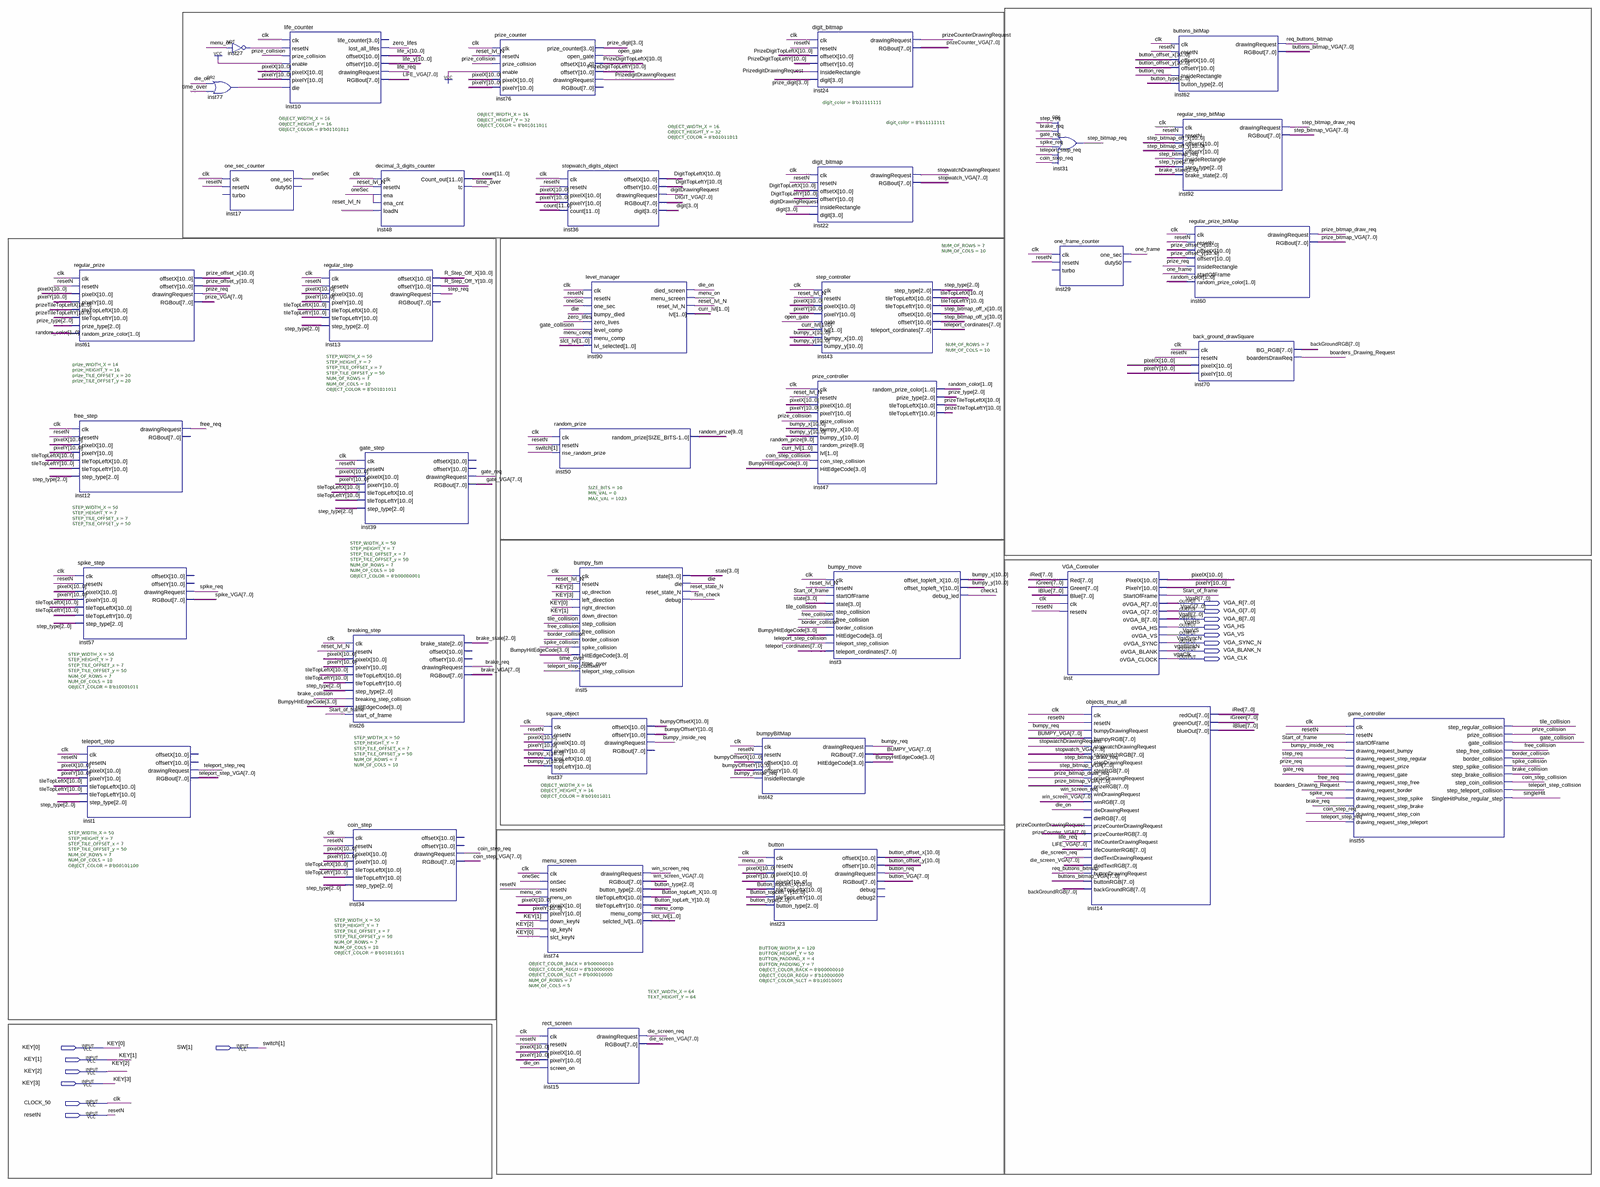
[diagram p0: schematic sheet, whole]
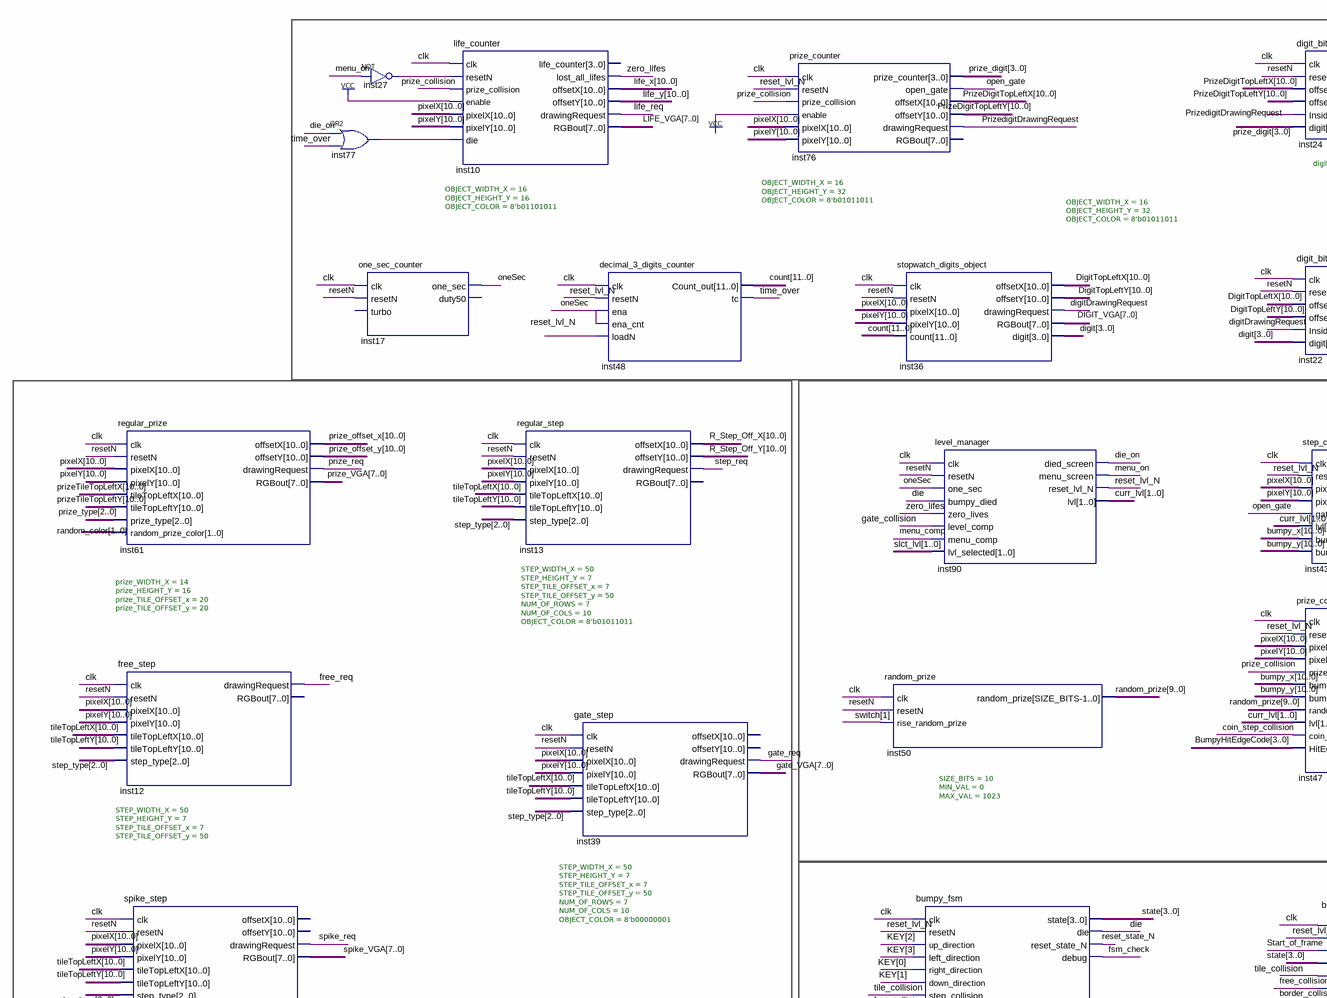
[diagram p1: schematic sheet, upper left part]
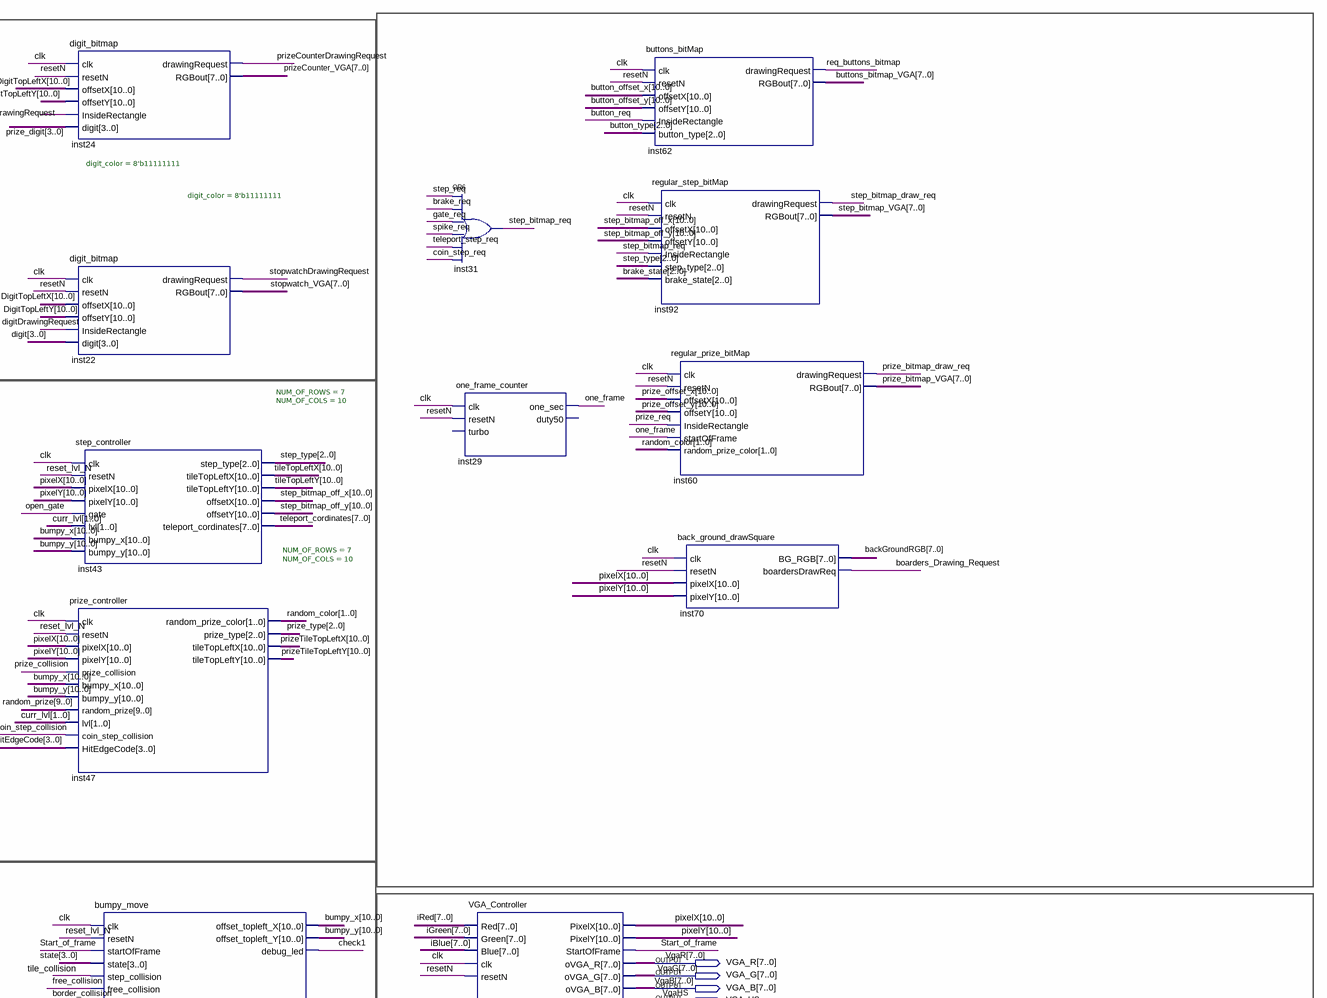
[diagram p2: schematic sheet, upper right part]
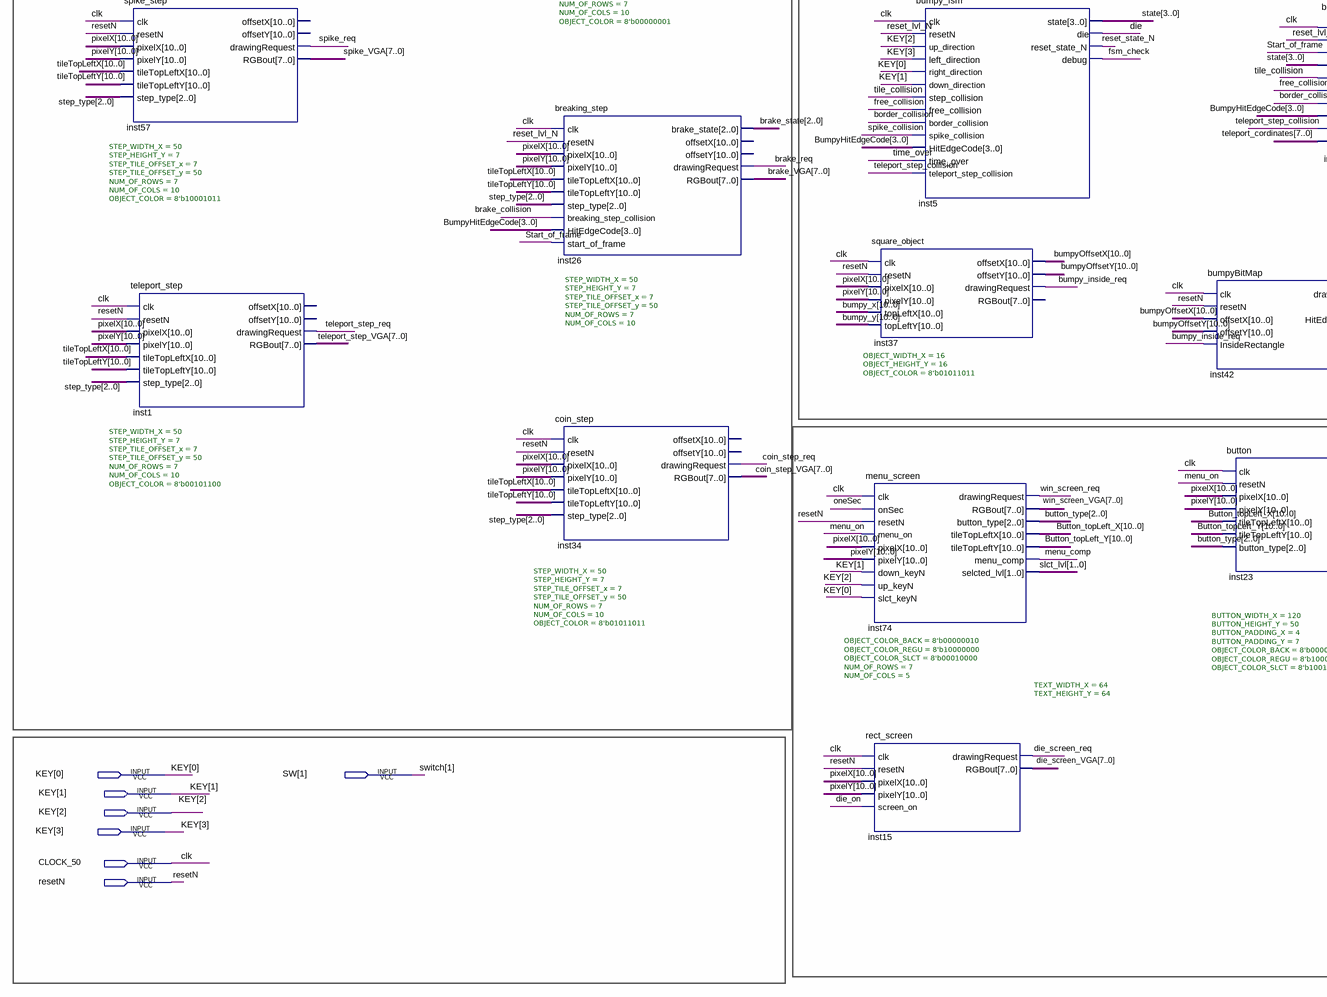
[diagram p3: schematic sheet, lower left part]
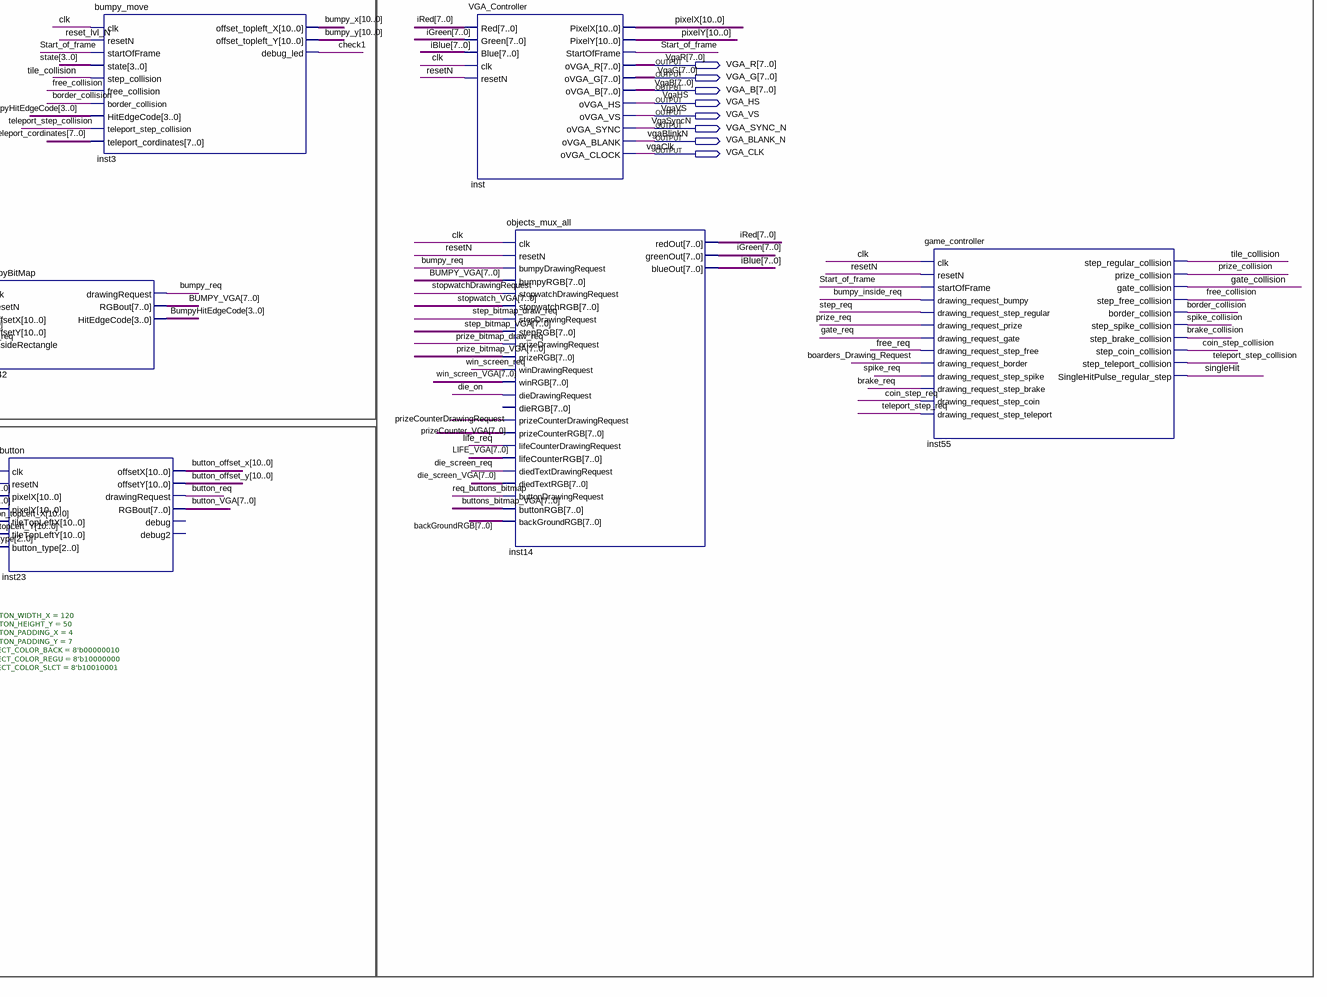
[diagram p4: schematic sheet, lower right part]
// Quartus schematic TOP_VGA_DEMO_WITH_MSS_ALL.bdf as structural Verilog: 37 symbols, 15 pins
module TOP_VGA_DEMO_WITH_MSS_ALL (
  input  [3:0] KEY,
  input  [1:1] SW,
  input  CLOCK_50,
  input  resetN,
  output [7:0] VGA_R,
  output [7:0] VGA_G,
  output [7:0] VGA_B,
  output VGA_HS,
  output VGA_VS,
  output VGA_SYNC_N,
  output VGA_BLANK_N,
  output VGA_CLK
);

  wire boarders_Drawing_Request, border_collision, brake_collision, brake_req, bumpy_inside_req, bumpy_req,
       button_req, check1, coin_step_collision, coin_step_req, die, die_on, die_screen_req,
       digitDrawingRequest, free_collision, free_req, fsm_check, gate_collision, gate_req, inst27_out,
       inst77_out, life_req, menu_comp, menu_on, one_frame, oneSec, open_gate, prize_bitmap_draw_req,
       prize_collision, prize_req, prizeCounterDrawingRequest, PrizedigitDrawingRequest, req_buttons_bitmap,
       reset_lvl_N, reset_state_N, singleHit, spike_collision, spike_req, Start_of_frame,
       step_bitmap_draw_req, step_bitmap_req, step_req, stopwatchDrawingRequest, teleport_step_collision,
       teleport_step_req, tile_collision, time_over, win_screen_req, zero_lifes;
  wire [1:0] curr_lvl, random_color, slct_lvl;
  wire [2:0] brake_state, button_type, prize_type, step_type;
  wire [3:0] BumpyHitEdgeCode, digit, prize_digit, state;
  wire [7:0] backGroundRGB, brake_VGA, BUMPY_VGA, button_VGA, buttons_bitmap_VGA, coin_step_VGA,
       die_screen_VGA, DIGIT_VGA, gate_VGA, iBlue, iGreen, iRed, LIFE_VGA, prize_bitmap_VGA, prize_VGA,
       prizeCounter_VGA, spike_VGA, step_bitmap_VGA, stopwatch_VGA, teleport_cordinates, teleport_step_VGA,
       win_screen_VGA;
  wire [9:0] random_prize;
  wire [10:0] bumpy_x, bumpy_y, bumpyOffsetX, bumpyOffsetY, button_offset_x, button_offset_y,
       Button_topLeft_X, Button_topLeft_Y, DigitTopLeftX, DigitTopLeftY, life_x, life_y, pixelX, pixelY,
       prize_offset_x, prize_offset_y, PrizeDigitTopLeftX, PrizeDigitTopLeftY, prizeTileTopLeftX,
       prizeTileTopLeftY, R_Step_Off_X, R_Step_Off_Y, step_bitmap_off_x, step_bitmap_off_y, tileTopLeftX,
       tileTopLeftY;
  wire [11:0] count;

  regular_prize #(.prize_WIDTH_X(14), .prize_HEIGHT_Y(16), .prize_TILE_OFFSET_x(20), .prize_TILE_OFFSET_y(20)) inst61 (
    .clk(CLOCK_50), .resetN(resetN), .pixelX(pixelX), .pixelY(pixelY), .tileTopLeftX(prizeTileTopLeftX),
    .tileTopLeftY(prizeTileTopLeftY), .prize_type(prize_type), .random_prize_color(random_color),
    .offsetX(prize_offset_x), .offsetY(prize_offset_y), .drawingRequest(prize_req), .RGBout(prize_VGA));
  free_step #(.STEP_WIDTH_X(50), .STEP_HEIGHT_Y(7), .STEP_TILE_OFFSET_x(7), .STEP_TILE_OFFSET_y(50)) inst12 (
    .clk(CLOCK_50), .resetN(resetN), .pixelX(pixelX), .pixelY(pixelY), .tileTopLeftX(tileTopLeftX),
    .tileTopLeftY(tileTopLeftY), .step_type(step_type), .drawingRequest(free_req));  // open: RGBout
  spike_step #(.STEP_WIDTH_X(50), .STEP_HEIGHT_Y(7), .STEP_TILE_OFFSET_x(7), .STEP_TILE_OFFSET_y(50), .NUM_OF_ROWS(7), .NUM_OF_COLS(10), .OBJECT_COLOR(8'b10001011)) inst57 (
    .clk(CLOCK_50), .resetN(resetN), .pixelX(pixelX), .pixelY(pixelY), .tileTopLeftX(tileTopLeftX),
    .tileTopLeftY(tileTopLeftY), .step_type(step_type), .drawingRequest(spike_req), .RGBout(spike_VGA));  // open: offsetX, offsetY
  teleport_step #(.STEP_WIDTH_X(50), .STEP_HEIGHT_Y(7), .STEP_TILE_OFFSET_x(7), .STEP_TILE_OFFSET_y(50), .NUM_OF_ROWS(7), .NUM_OF_COLS(10), .OBJECT_COLOR(8'b00101100)) inst1 (
    .clk(CLOCK_50), .resetN(resetN), .pixelX(pixelX), .pixelY(pixelY), .tileTopLeftX(tileTopLeftX),
    .tileTopLeftY(tileTopLeftY), .step_type(step_type), .drawingRequest(teleport_step_req),
    .RGBout(teleport_step_VGA));  // open: offsetX, offsetY
  not inst27 (inst27_out, menu_on);
  or inst77 (inst77_out, die_on, time_over);
  one_sec_counter inst17 (.clk(CLOCK_50), .resetN(resetN), .one_sec(oneSec));  // open: turbo, duty50
  life_counter #(.OBJECT_WIDTH_X(16), .OBJECT_HEIGHT_Y(16), .OBJECT_COLOR(8'b01101011)) inst10 (
    .clk(CLOCK_50), .resetN(inst27_out), .prize_collision(prize_collision), .enable(1'b1), .pixelX(pixelX),
    .pixelY(pixelY), .die(inst77_out), .lost_all_lifes(zero_lifes), .offsetX(life_x), .offsetY(life_y),
    .drawingRequest(life_req), .RGBout(LIFE_VGA));  // open: life_counter
  regular_step #(.STEP_WIDTH_X(50), .STEP_HEIGHT_Y(7), .STEP_TILE_OFFSET_x(7), .STEP_TILE_OFFSET_y(50), .NUM_OF_ROWS(7), .NUM_OF_COLS(10), .OBJECT_COLOR(8'b01011011)) inst13 (
    .clk(CLOCK_50), .resetN(resetN), .pixelX(pixelX), .pixelY(pixelY), .tileTopLeftX(tileTopLeftX),
    .tileTopLeftY(tileTopLeftY), .step_type(step_type), .offsetX(R_Step_Off_X), .offsetY(R_Step_Off_Y),
    .drawingRequest(step_req));  // open: RGBout
  breaking_step #(.STEP_WIDTH_X(50), .STEP_HEIGHT_Y(7), .STEP_TILE_OFFSET_x(7), .STEP_TILE_OFFSET_y(50), .NUM_OF_ROWS(7), .NUM_OF_COLS(10)) inst26 (
    .clk(CLOCK_50), .resetN(reset_lvl_N), .pixelX(pixelX), .pixelY(pixelY), .tileTopLeftX(tileTopLeftX),
    .tileTopLeftY(tileTopLeftY), .step_type(step_type), .breaking_step_collision(brake_collision),
    .HitEdgeCode(BumpyHitEdgeCode), .start_of_frame(Start_of_frame), .brake_state(brake_state),
    .drawingRequest(brake_req), .RGBout(brake_VGA));  // open: offsetX, offsetY
  coin_step #(.STEP_WIDTH_X(50), .STEP_HEIGHT_Y(7), .STEP_TILE_OFFSET_x(7), .STEP_TILE_OFFSET_y(50), .NUM_OF_ROWS(7), .NUM_OF_COLS(10), .OBJECT_COLOR(8'b01011011)) inst34 (
    .clk(CLOCK_50), .resetN(resetN), .pixelX(pixelX), .pixelY(pixelY), .tileTopLeftX(tileTopLeftX),
    .tileTopLeftY(tileTopLeftY), .step_type(step_type), .drawingRequest(coin_step_req), .RGBout(coin_step_VGA));  // open: offsetX, offsetY
  decimal_3_digits_counter inst48 (
    .clk(CLOCK_50), .resetN(reset_lvl_N), .ena(oneSec), .ena_cnt(oneSec), .loadN(reset_lvl_N),
    .Count_out(count), .tc(time_over));
  gate_step #(.STEP_WIDTH_X(50), .STEP_HEIGHT_Y(7), .STEP_TILE_OFFSET_x(7), .STEP_TILE_OFFSET_y(50), .NUM_OF_ROWS(7), .NUM_OF_COLS(10), .OBJECT_COLOR(8'b00000001)) inst39 (
    .clk(CLOCK_50), .resetN(resetN), .pixelX(pixelX), .pixelY(pixelY), .tileTopLeftX(tileTopLeftX),
    .tileTopLeftY(tileTopLeftY), .step_type(step_type), .drawingRequest(gate_req), .RGBout(gate_VGA));  // open: offsetX, offsetY
  prize_counter #(.OBJECT_WIDTH_X(16), .OBJECT_HEIGHT_Y(32), .OBJECT_COLOR(8'b01011011)) inst76 (
    .clk(CLOCK_50), .resetN(reset_lvl_N), .prize_collision(prize_collision), .enable(1'b1), .pixelX(pixelX),
    .pixelY(pixelY), .prize_counter(prize_digit), .open_gate(open_gate), .offsetX(PrizeDigitTopLeftX),
    .offsetY(PrizeDigitTopLeftY), .drawingRequest(PrizedigitDrawingRequest));  // open: RGBout
  square_object #(.OBJECT_WIDTH_X(16), .OBJECT_HEIGHT_Y(16), .OBJECT_COLOR(8'b01011011)) inst37 (
    .clk(CLOCK_50), .resetN(resetN), .pixelX(pixelX), .pixelY(pixelY), .topLeftX(bumpy_x),
    .topLeftY(bumpy_y), .offsetX(bumpyOffsetX), .offsetY(bumpyOffsetY), .drawingRequest(bumpy_inside_req));  // open: RGBout
  menu_screen #(.OBJECT_COLOR_BACK(8'b00000010), .OBJECT_COLOR_REGU(8'b10000000), .OBJECT_COLOR_SLCT(8'b00010000), .NUM_OF_ROWS(7), .NUM_OF_COLS(5)) inst74 (
    .clk(CLOCK_50), .onSec(oneSec), .resetN(resetN), .menu_on(menu_on), .pixelX(pixelX), .pixelY(pixelY),
    .down_keyN(KEY[1]), .up_keyN(KEY[2]), .slct_keyN(KEY[0]), .drawingRequest(win_screen_req),
    .RGBout(win_screen_VGA), .button_type(button_type), .tileTopLeftX(Button_topLeft_X),
    .tileTopLeftY(Button_topLeft_Y), .menu_comp(menu_comp), .selcted_lvl(slct_lvl));
  rect_screen #(.TEXT_WIDTH_X(64), .TEXT_HEIGHT_Y(64)) inst15 (
    .clk(CLOCK_50), .resetN(resetN), .pixelX(pixelX), .pixelY(pixelY), .screen_on(die_on),
    .drawingRequest(die_screen_req), .RGBout(die_screen_VGA));
  stopwatch_digits_object #(.OBJECT_WIDTH_X(16), .OBJECT_HEIGHT_Y(32), .OBJECT_COLOR(8'b01011011)) inst36 (
    .clk(CLOCK_50), .resetN(resetN), .pixelX(pixelX), .pixelY(pixelY), .count(count),
    .offsetX(DigitTopLeftX), .offsetY(DigitTopLeftY), .drawingRequest(digitDrawingRequest),
    .RGBout(DIGIT_VGA), .digit(digit));
  random_prize #(.SIZE_BITS(10), .MIN_VAL(0), .MAX_VAL(1023)) inst50 (
    .clk(CLOCK_50), .resetN(resetN), .rise_random_prize(SW[1]), .random_prize(random_prize));
  bumpy_fsm inst5 (
    .clk(CLOCK_50), .resetN(reset_lvl_N), .up_direction(KEY[2]), .left_direction(KEY[3]),
    .right_direction(KEY[0]), .down_direction(KEY[1]), .step_collision(tile_collision),
    .free_collision(free_collision), .border_collision(border_collision), .spike_collision(spike_collision),
    .HitEdgeCode(BumpyHitEdgeCode), .time_over(time_over), .teleport_step_collision(teleport_step_collision),
    .state(state), .die(die), .reset_state_N(reset_state_N), .debug(fsm_check));
  level_manager inst90 (
    .clk(CLOCK_50), .resetN(resetN), .one_sec(oneSec), .bumpy_died(die), .zero_lives(zero_lifes),
    .level_comp(gate_collision), .menu_comp(menu_comp), .lvl_selected(slct_lvl), .died_screen(die_on),
    .menu_screen(menu_on), .reset_lvl_N(reset_lvl_N), .lvl(curr_lvl));
  bumpyBitMap inst42 (
    .clk(CLOCK_50), .resetN(resetN), .offsetX(bumpyOffsetX), .offsetY(bumpyOffsetY),
    .InsideRectangle(bumpy_inside_req), .drawingRequest(bumpy_req), .RGBout(BUMPY_VGA),
    .HitEdgeCode(BumpyHitEdgeCode));
  button #(.BUTTON_WIDTH_X(120), .BUTTON_HEIGHT_Y(50), .BUTTON_PADDING_X(4), .BUTTON_PADDING_Y(7), .OBJECT_COLOR_BACK(8'b00000010), .OBJECT_COLOR_REGU(8'b10000000), .OBJECT_COLOR_SLCT(8'b10010001)) inst23 (
    .clk(CLOCK_50), .resetN(menu_on), .pixelX(pixelX), .pixelY(pixelY), .tileTopLeftX(Button_topLeft_X),
    .tileTopLeftY(Button_topLeft_Y), .button_type(button_type), .offsetX(button_offset_x),
    .offsetY(button_offset_y), .drawingRequest(button_req), .RGBout(button_VGA));  // open: debug, debug2
  digit_bitmap #(.digit_color(8'b11111111)) inst24 (
    .clk(CLOCK_50), .resetN(resetN), .offsetX(PrizeDigitTopLeftX), .offsetY(PrizeDigitTopLeftY),
    .InsideRectangle(PrizedigitDrawingRequest), .digit(prize_digit),
    .drawingRequest(prizeCounterDrawingRequest), .RGBout(prizeCounter_VGA));
  digit_bitmap #(.digit_color(8'b11111111)) inst22 (
    .clk(CLOCK_50), .resetN(resetN), .offsetX(DigitTopLeftX), .offsetY(DigitTopLeftY),
    .InsideRectangle(digitDrawingRequest), .digit(digit), .drawingRequest(stopwatchDrawingRequest),
    .RGBout(stopwatch_VGA));
  step_controller #(.NUM_OF_ROWS(7), .NUM_OF_COLS(10)) inst43 (
    .clk(CLOCK_50), .resetN(reset_lvl_N), .pixelX(pixelX), .pixelY(pixelY), .gate(open_gate), .lvl(curr_lvl),
    .bumpy_x(bumpy_x), .bumpy_y(bumpy_y), .step_type(step_type), .tileTopLeftX(tileTopLeftX),
    .tileTopLeftY(tileTopLeftY), .offsetX(step_bitmap_off_x), .offsetY(step_bitmap_off_y),
    .teleport_cordinates(teleport_cordinates));
  prize_controller #(.NUM_OF_ROWS(7), .NUM_OF_COLS(10)) inst47 (
    .clk(CLOCK_50), .resetN(reset_lvl_N), .pixelX(pixelX), .pixelY(pixelY),
    .prize_collision(prize_collision), .bumpy_x(bumpy_x), .bumpy_y(bumpy_y), .random_prize(random_prize),
    .lvl(curr_lvl), .coin_step_collision(coin_step_collision), .HitEdgeCode(BumpyHitEdgeCode),
    .random_prize_color(random_color), .prize_type(prize_type), .tileTopLeftX(prizeTileTopLeftX),
    .tileTopLeftY(prizeTileTopLeftY));
  bumpy_move inst3 (
    .clk(CLOCK_50), .resetN(reset_lvl_N), .startOfFrame(Start_of_frame), .state(state),
    .step_collision(tile_collision), .free_collision(free_collision), .border_collision(border_collision),
    .HitEdgeCode(BumpyHitEdgeCode), .teleport_step_collision(teleport_step_collision),
    .teleport_cordinates(teleport_cordinates), .offset_topleft_X(bumpy_x), .offset_topleft_Y(bumpy_y),
    .debug_led(check1));
  or inst31 (step_bitmap_req, step_req, brake_req, gate_req, spike_req, teleport_step_req, coin_step_req);
  one_frame_counter inst29 (.clk(CLOCK_50), .resetN(resetN), .one_sec(one_frame));  // open: turbo, duty50
  VGA_Controller inst (
    .Red(iRed), .Green(iGreen), .Blue(iBlue), .clk(CLOCK_50), .resetN(resetN), .PixelX(pixelX),
    .PixelY(pixelY), .StartOfFrame(Start_of_frame), .oVGA_R(VGA_R), .oVGA_G(VGA_G), .oVGA_B(VGA_B),
    .oVGA_HS(VGA_HS), .oVGA_VS(VGA_VS), .oVGA_SYNC(VGA_SYNC_N), .oVGA_BLANK(VGA_BLANK_N), .oVGA_CLOCK(VGA_CLK));
  objects_mux_all inst14 (
    .clk(CLOCK_50), .resetN(resetN), .bumpyDrawingRequest(bumpy_req), .bumpyRGB(BUMPY_VGA),
    .stopwatchDrawingRequest(stopwatchDrawingRequest), .stopwatchRGB(stopwatch_VGA),
    .stepDrawingRequest(step_bitmap_draw_req), .stepRGB(step_bitmap_VGA),
    .prizeDrawingRequest(prize_bitmap_draw_req), .prizeRGB(prize_bitmap_VGA),
    .winDrawingRequest(win_screen_req), .winRGB(win_screen_VGA), .dieDrawingRequest(die_on),
    .prizeCounterDrawingRequest(prizeCounterDrawingRequest), .prizeCounterRGB(prizeCounter_VGA),
    .lifeCounterDrawingRequest(life_req), .lifeCounterRGB(LIFE_VGA), .diedTextDrawingRequest(die_screen_req),
    .diedTextRGB(die_screen_VGA), .buttonDrawingRequest(req_buttons_bitmap), .buttonRGB(buttons_bitmap_VGA),
    .backGroundRGB(backGroundRGB), .redOut(iRed), .greenOut(iGreen), .blueOut(iBlue));  // open: dieRGB
  buttons_bitMap inst62 (
    .clk(CLOCK_50), .resetN(resetN), .offsetX(button_offset_x), .offsetY(button_offset_y),
    .InsideRectangle(button_req), .button_type(button_type), .drawingRequest(req_buttons_bitmap),
    .RGBout(buttons_bitmap_VGA));
  regular_step_bitMap inst92 (
    .clk(CLOCK_50), .resetN(resetN), .offsetX(step_bitmap_off_x), .offsetY(step_bitmap_off_y),
    .InsideRectangle(step_bitmap_req), .step_type(step_type), .brake_state(brake_state),
    .drawingRequest(step_bitmap_draw_req), .RGBout(step_bitmap_VGA));
  regular_prize_bitMap inst60 (
    .clk(CLOCK_50), .resetN(resetN), .offsetX(prize_offset_x), .offsetY(prize_offset_y),
    .InsideRectangle(prize_req), .startOfFrame(one_frame), .random_prize_color(random_color),
    .drawingRequest(prize_bitmap_draw_req), .RGBout(prize_bitmap_VGA));
  back_ground_drawSquare inst70 (
    .clk(CLOCK_50), .resetN(resetN), .pixelX(pixelX), .pixelY(pixelY), .BG_RGB(backGroundRGB),
    .boardersDrawReq(boarders_Drawing_Request));
  game_controller inst55 (
    .clk(CLOCK_50), .resetN(resetN), .startOfFrame(Start_of_frame), .drawing_request_bumpy(bumpy_inside_req),
    .drawing_request_step_regular(step_req), .drawing_request_prize(prize_req),
    .drawing_request_gate(gate_req), .drawing_request_step_free(free_req),
    .drawing_request_border(boarders_Drawing_Request), .drawing_request_step_spike(spike_req),
    .drawing_request_step_brake(brake_req), .drawing_request_step_coin(coin_step_req),
    .drawing_request_step_teleport(teleport_step_req), .step_regular_collision(tile_collision),
    .prize_collision(prize_collision), .gate_collision(gate_collision), .step_free_collision(free_collision),
    .border_collision(border_collision), .step_spike_collision(spike_collision),
    .step_brake_collision(brake_collision), .step_coin_collision(coin_step_collision),
    .step_teleport_collision(teleport_step_collision), .SingleHitPulse_regular_step(singleHit));

  // Other names for the same wires on the sheet: clk = CLOCK_50; switch[1] = SW[1]; VgaB[7:0] = VGA_B;
  //   vgaBlinkN = VGA_BLANK_N; vgaClk = VGA_CLK; VgaG[7:0] = VGA_G; VgaHS = VGA_HS; VgaR[7:0] = VGA_R;
  //   VgaSyncN = VGA_SYNC_N; VgaVS = VGA_VS
endmodule
